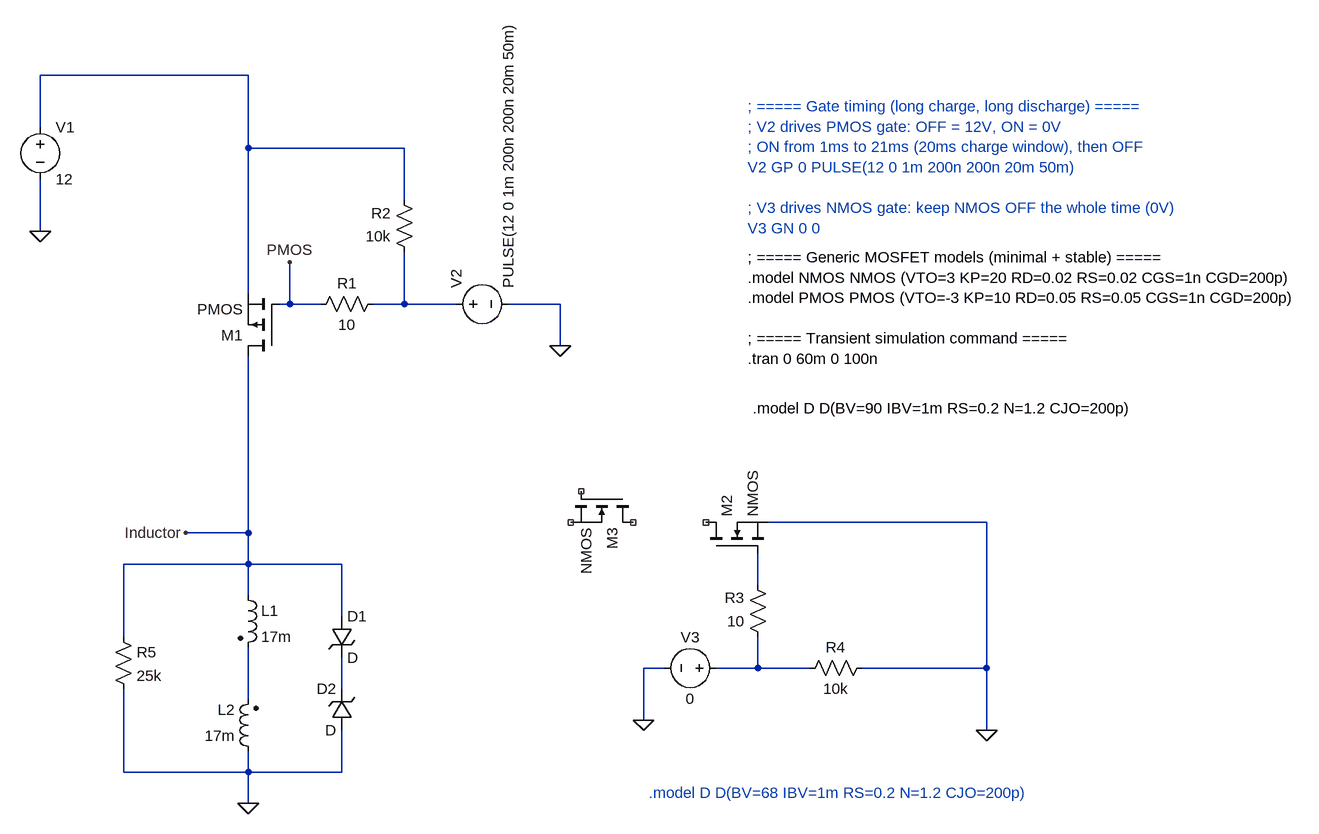
[diagram p0: schematic SP26_HookLineandTowfish_SwitchingSimulation_JamesBrasfield.asc]
SP26_HookLineandTowfish_SwitchingSimulation_JamesBrasfield.asc, the LTspice schematic file:
Version 4
SHEET 1 1856 804
WIRE 160 -336 -160 -336
WIRE -160 -256 -160 -336
WIRE 160 -224 160 -336
WIRE 400 -224 160 -224
WIRE 400 -144 400 -224
WIRE -160 -96 -160 -176
WIRE 160 0 160 -224
WIRE 224 16 224 -48
WIRE 224 16 208 16
WIRE 272 16 224 16
WIRE 400 16 400 -64
WIRE 400 16 352 16
WIRE 480 16 400 16
WIRE 640 16 560 16
WIRE 640 80 640 16
WIRE 1296 352 960 352
WIRE 160 368 160 96
WIRE 160 368 64 368
WIRE 160 416 160 368
WIRE 160 416 -32 416
WIRE 304 416 160 416
WIRE 944 448 944 400
WIRE 160 464 160 416
WIRE 304 496 304 416
WIRE -32 528 -32 416
WIRE 800 576 768 576
WIRE 944 576 944 528
WIRE 944 576 880 576
WIRE 1024 576 944 576
WIRE 1296 576 1296 352
WIRE 1296 576 1104 576
WIRE 304 608 304 560
WIRE 160 624 160 544
WIRE 768 656 768 576
WIRE 1296 672 1296 576
WIRE -32 736 -32 608
WIRE 160 736 160 704
WIRE 160 736 -32 736
WIRE 304 736 304 672
WIRE 304 736 160 736
WIRE 160 784 160 736
FLAG 1296 672 0
FLAG -160 -96 0
FLAG 160 784 0
FLAG 768 656 0
FLAG 64 368 Inductor
FLAG 224 -48 PMOS
FLAG 640 80 0
SYMBOL pmos 208 96 R180
SYMATTR InstName M1
SYMBOL nmos 864 400 R270
SYMATTR InstName M2
SYMBOL res 368 0 R90
WINDOW 0 0 56 VBottom 2
WINDOW 3 32 56 VTop 2
SYMATTR InstName R1
SYMATTR Value 10
SYMBOL res 416 -48 R180
WINDOW 0 36 76 Left 2
WINDOW 3 36 40 Left 2
SYMATTR InstName R2
SYMATTR Value 10k
SYMBOL res 960 544 R180
WINDOW 0 36 76 Left 2
WINDOW 3 36 40 Left 2
SYMATTR InstName R3
SYMATTR Value 10
SYMBOL res 1008 592 R270
WINDOW 0 32 56 VTop 2
WINDOW 3 0 56 VBottom 2
SYMATTR InstName R4
SYMATTR Value 10k
SYMBOL ind2 144 448 R0
SYMATTR InstName L1
SYMATTR Value 17m
SYMATTR Type ind
SYMATTR SpiceLine Rser=9
SYMBOL ind2 176 720 R180
WINDOW 0 36 80 Left 2
WINDOW 3 36 40 Left 2
SYMATTR InstName L2
SYMATTR Value 17m
SYMATTR Type ind
SYMATTR SpiceLine Rser=9
SYMBOL voltage -160 -272 R0
WINDOW 123 0 0 Left 0
WINDOW 39 0 0 Left 0
SYMATTR InstName V1
SYMATTR Value 12
SYMBOL voltage 896 576 R90
WINDOW 0 -32 56 VBottom 2
WINDOW 3 32 56 VTop 2
WINDOW 123 0 0 Left 0
WINDOW 39 0 0 Left 0
SYMATTR InstName V3
SYMATTR Value 0
SYMBOL zener 288 496 R0
SYMATTR InstName D1
SYMBOL zener 320 672 R180
WINDOW 0 24 64 Left 2
WINDOW 3 24 0 Left 2
SYMATTR InstName D2
SYMBOL res -48 512 R0
SYMATTR InstName R5
SYMATTR Value 25k
SYMBOL nmos 752 304 R90
SYMATTR InstName M3
SYMBOL voltage 464 16 R270
WINDOW 123 0 0 Left 0
WINDOW 39 0 0 Left 0
SYMATTR InstName V2
SYMATTR Value PULSE(12 0 1m 200n 200n 20m 50m)
TEXT 776 768 Left 2 ;.model D D(BV=68 IBV=1m RS=0.2 N=1.2 CJO=200p)
TEXT 928 -288 Left 2 ;; ===== Gate timing (long charge, long discharge) =====\n; V2 drives PMOS gate: OFF = 12V, ON = 0V\n; ON from 1ms to 21ms (20ms charge window), then OFF\nV2 GP 0 PULSE(12 0 1m 200n 200n 20m 50m)\n \n; V3 drives NMOS gate: keep NMOS OFF the whole time (0V)\nV3 GN 0 0
TEXT 928 -56 Left 2 !; ===== Generic MOSFET models (minimal + stable) =====\n.model NMOS NMOS (VTO=3 KP=20 RD=0.02 RS=0.02 CGS=1n CGD=200p)\n.model PMOS PMOS (VTO=-3 KP=10 RD=0.05 RS=0.05 CGS=1n CGD=200p)\n \n; ===== Transient simulation command =====\n.tran 0 60m 0 100n
TEXT 936 176 Left 2 !.model D D(BV=90 IBV=1m RS=0.2 N=1.2 CJO=200p)

The netlist it stands for:
* SP26_HookLineandTowfish_SwitchingSimulation_JamesBrasfield.asc
M1 Inductor PMOS N001 N001 PMOS
M2 NC_01 N003 0 0 NMOS
R1 N002 PMOS 10
R2 N002 N001 10k
R3 N004 N003 10
R4 N004 0 10k
L1 Inductor N006 17m Rser=9
L2 0 N006 17m Rser=9
V1 N001 0 12
V3 N004 0 0
D1 Inductor N005 D
D2 0 N005 D
R5 Inductor 0 25k
M3 NC_02 NC_03 NC_04 NC_04 NMOS
V2 N002 0 PULSE(12 0 1m 200n 200n 20m 50m)
.model D D
.lib standard.dio
.model NMOS NMOS
.model PMOS PMOS
.lib standard.mos
* .model D D(BV=68 IBV=1m RS=0.2 N=1.2 CJO=200p)
* ; ===== Gate timing (long charge, long discharge) =====
* ; V2 drives PMOS gate: OFF = 12V, ON = 0V
* ; ON from 1ms to 21ms (20ms charge window), then OFF
* V2 GP 0 PULSE(12 0 1m 200n 200n 20m 50m)
* ; V3 drives NMOS gate: keep NMOS OFF the whole time (0V)
* V3 GN 0 0
; ===== Generic MOSFET models (minimal + stable) =====
.model NMOS NMOS (VTO=3 KP=20 RD=0.02 RS=0.02 CGS=1n CGD=200p)
.model PMOS PMOS (VTO=-3 KP=10 RD=0.05 RS=0.05 CGS=1n CGD=200p)
; ===== Transient simulation command =====
.tran 0 60m 0 100n
.model D D(BV=90 IBV=1m RS=0.2 N=1.2 CJO=200p)
.backanno
.end